# EAGLE design temp_draft (EAGLE 9.6.2)
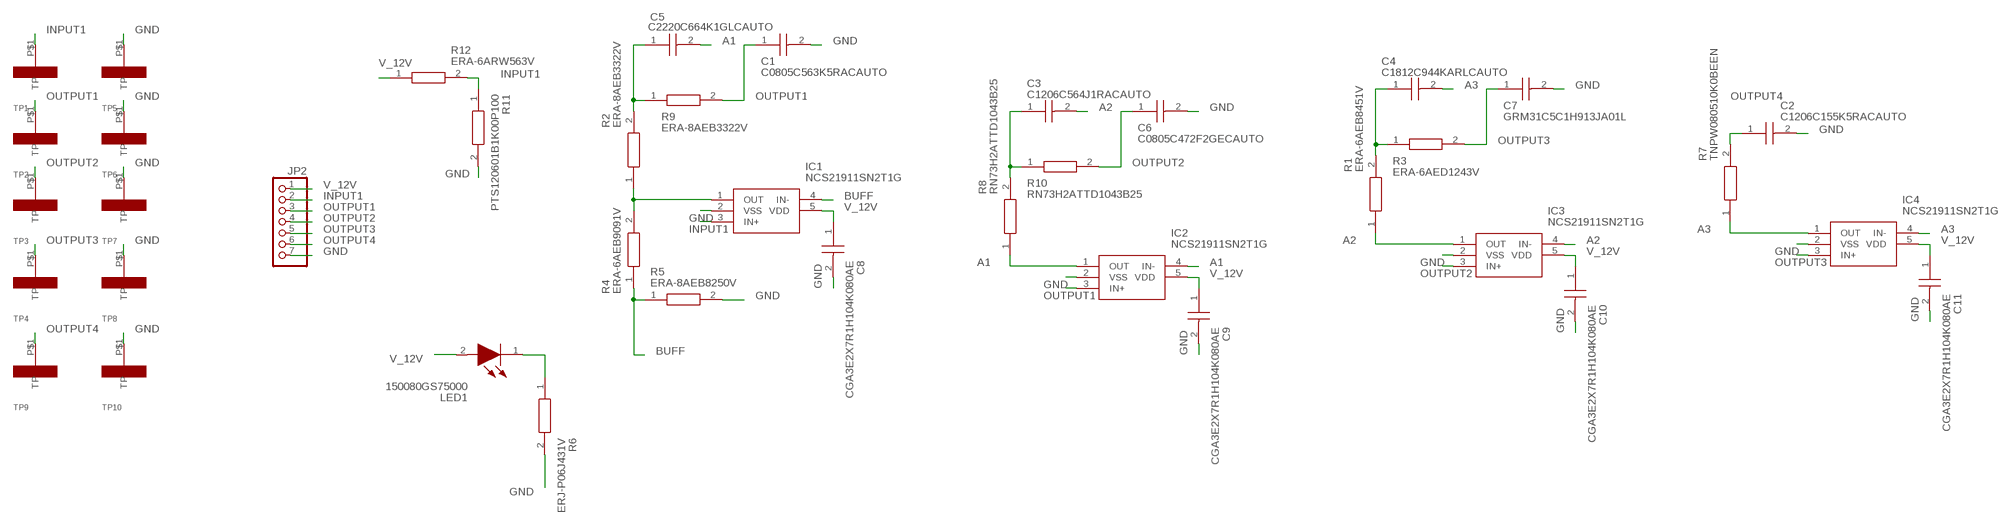
[diagram p0: schematic, sheet 1]

## Parts
C1  C0805C563K5RACAUTO  [CAPC0805C563K]
C2  C1206C155K5RACAUTO  [CAPC1206C]
C3  C1206C564J1RACAUTO  [CAPC1206]
C4  C1812C944KARLCAUTO  [CAPC4532X380N]
C5  C2220C664K1GLCAUTO  [CAPC2220]
C6  C0805C472F2GECAUTO  [CAPC2012X100N]
C7  GRM31C5C1H913JA01L  [CAPC3216X180N]
C8  CGA3E2X7R1H104K080AE  [CAPC1608X90N]
C9  CGA3E2X7R1H104K080AE  [CAPC1608X90N]
C10  CGA3E2X7R1H104K080AE  [CAPC1608X90N]
C11  CGA3E2X7R1H104K080AE  [CAPC1608X90N]
IC1  NCS21911SN2T1G  [SOT95P275X110-5N]
IC2  NCS21911SN2T1G  [SOT95P275X110-5N]
IC3  NCS21911SN2T1G  [SOT95P275X110-5N]
IC4  NCS21911SN2T1G  [SOT95P275X110-5N]
JP2  PINHD-1X7  [1X07]
LED1  150080GS75000  [LEDM2012X80N]
R1  ERA-6AEB8451V  [ERA6A_(0805)]
R2  ERA-8AEB3322V  [ERA8A_(0805)]
R3  ERA-6AED1243V  [ERA6A_(0805)]
R4  ERA-6AEB9091V  [ERA6A_(0805)]
R5  ERA-8AEB8250V  [ERA8A_(0805)]
R6  ERJ-P06J431V  [ERJP06_(0805)]
R7  TNPW080510K0BEEN  [RESC2013X65N]
R8  RN73H2ATTD1043B25  [ERA6A_(0805)]
R9  ERA-8AEB3322V  [ERA8A_(0805)]
R10  RN73H2ATTD1043B25  [ERA6A_(0805)]
R11  PTS120601B1K00P100  [PTS1206]
R12  ERA-6ARW563V  [ERA6A_(0805)]
TP1  S1751-46R  [1.85X3.45_MM]
TP2  S1751-46R  [1.85X3.45_MM]
TP3  S1751-46R  [1.85X3.45_MM]
TP4  S1751-46R  [1.85X3.45_MM]
TP5  S1751-46R  [1.85X3.45_MM]
TP6  S1751-46R  [1.85X3.45_MM]
TP7  S1751-46R  [1.85X3.45_MM]
TP8  S1751-46R  [1.85X3.45_MM]
TP9  S1751-46R  [1.85X3.45_MM]
TP10  S1751-46R  [1.85X3.45_MM]

## Nets
A1: C5.2 IC2.1(OUT) IC2.4(IN-) R8.1
A2: C3.2 IC3.1(OUT) IC3.4(IN-) R1.1
A3: C4.2 IC4.1(OUT) IC4.4(IN-) R7.1
BUFF: IC1.4(IN-) R4.1 R5.1
GND: C1.2 C2.2 C6.2 C7.2 C8.2 C9.2 C10.2 C11.2 IC1.2(VSS) IC2.2(VSS) IC3.2(VSS) IC4.2(VSS) JP2.7 R5.2 R6.2 R11.2 TP5.P$1(TP) TP6.P$1(TP) TP7.P$1(TP) TP8.P$1(TP) TP10.P$1(TP)
INPUT1: IC1.3(IN+) JP2.2 R11.1 R12.2 TP1.P$1(TP)
N$1: IC1.1(OUT) R2.1 R4.2
N$5: C3.1 R8.2 R10.1
N$6: C5.1 R2.2 R9.1
N$7: C4.1 R1.2 R3.1
N$20: LED1.1(K) R6.1
OUTPUT1: C1.1 IC2.3(IN+) JP2.3 R9.2 TP2.P$1(TP)
OUTPUT2: C6.1 IC3.3(IN+) JP2.4 R10.2 TP3.P$1(TP)
OUTPUT3: C7.1 IC4.3(IN+) JP2.5 R3.2 TP4.P$1(TP)
OUTPUT4: C2.1 JP2.6 R7.2 TP9.P$1(TP)
V_12V: C8.1 C9.1 C10.1 C11.1 IC1.5(VDD) IC2.5(VDD) IC3.5(VDD) IC4.5(VDD) JP2.1 LED1.2(A) R12.1

## Library data of the parts
C1 = SamacSys_Parts:C0805C563K5RACAUTO: Multilayer Ceramic Capacitors MLCC - SMD/SMT 50V 0.056uF X7R 0805 10% AEC-Q200 Source: Datasheet <https://www.mouser.com/datasheet/2/212/KEM_C1023_X7R_AUTO_SMD-1093309.pdf>; DESCRIPTION: Multilayer Ceramic Capacitors MLCC - SMD/SMT 50V 0.056uF X7R 0805 10% AEC-Q200; HEIGHT: 0.9mm; MANUFACTURER_NAME: Kemet; MANUFACTURE_PART_NUMBER: C0805C563K5RACAUTO; MOUSER_PART_NUMBER: 80-C0805C563K5RAUTO; MOUSER_PRICE-STOCK: https://www.mouser.com/ProductDetail/KEMET/C0805C563K5RACAUTO?qs=sGAEpiMZZMvsSlwiRhF8qhq1yIqtqizHj9MHQJANp6GepaPhQIZJkQ%3D%3D
C2 = SamacSys_Parts:C1206C155K5RACAUTO: Multilayer Ceramic Capacitors MLCC - SMD/SMT 50V 1.5uF X7R 1206 10% AEC-Q200 Source: Datasheet <https://www.mouser.com/datasheet/2/212/KEM_C1023_X7R_AUTO_SMD-1093309.pdf>; DESCRIPTION: Multilayer Ceramic Capacitors MLCC - SMD/SMT 50V 1.5uF X7R 1206 10% AEC-Q200; HEIGHT: 1.6mm; MANUFACTURER_NAME: Kemet; MANUFACTURE_PART_NUMBER: C1206C155K5RACAUTO; MOUSER_PART_NUMBER: 80-C1206C155K5RAUTO; MOUSER_PRICE-STOCK: https://www.mouser.com/ProductDetail/KEMET/C1206C155K5RACAUTO?qs=sGAEpiMZZMvsSlwiRhF8qtsBU8Zhqm2RiyVNR5SAROER%2FOmnVcYfaQ%3D%3D
C3 = SamacSys_Parts:C1206C564J1RACAUTO: Multilayer Ceramic Capacitors MLCC - SMD/SMT 100V 0.56uF X7R 1206 5% AEC-Q200 Source: Datasheet <https://www.mouser.com/ProductDetail/KEMET/C1206C564J1RACAUTO?qs=sGAEpiMZZMvsSlwiRhF8qtbmv%2FbKa1yYUWBlfJVYdwVDZKQkcrnd%2Fw%3D%3D>; DESCRIPTION: Multilayer Ceramic Capacitors MLCC - SMD/SMT 100V 0.56uF X7R 1206 5% AEC-Q200; HEIGHT: 1.25mm; MANUFACTURER_NAME: Kemet; MANUFACTURE_PART_NUMBER: C1206C564J1RACAUTO; MOUSER_PART_NUMBER: 80-C1206C564J1RAUTO; MOUSER_PRICE-STOCK: https://www.mouser.com/ProductDetail/KEMET/C1206C564J1RACAUTO?qs=sGAEpiMZZMvsSlwiRhF8qtbmv%2FbKa1yYUWBlfJVYdwVDZKQkcrnd%2Fw%3D%3D
C4 = SamacSys_Parts:C1812C944KARLCAUTO: Multilayer Ceramic Capacitors MLCC - SMD/SMT 250V 0.94uF X7R 1812 10% AEC-Q200 Source: Datasheet <https://www.kemet.com/specsheet/C1812C944KARLCAUTO>; DESCRIPTION: Multilayer Ceramic Capacitors MLCC - SMD/SMT 250V 0.94uF X7R 1812 10% AEC-Q200; HEIGHT: 3.8mm; MANUFACTURER_NAME: Kemet; MANUFACTURER_PART_NUMBER: C1812C944KARLCAUTO; MOUSER_PART_NUMBER: 80-C1812C944KARLAUTO; MOUSER_PRICE-STOCK: https://www.mouser.co.uk/ProductDetail/KEMET/C1812C944KARLCAUTO/?qs=W%2FMpXkg%252BdQ506CIIBjctjQ%3D%3D
C5 = SamacSys_Parts:C2220C664K1GLCAUTO: Multilayer Ceramic Capacitors MLCC - SMD/SMT 100V 660KpF 2220 C0G w/KONNEKT AECQ2 Source: Datasheet <https://www.mouser.com/datasheet/2/212/1/KEM_C1113_KONNEKT_C0G-2584775.pdf>; DESCRIPTION: Multilayer Ceramic Capacitors MLCC - SMD/SMT 100V 660KpF 2220 C0G w/KONNEKT AECQ2; HEIGHT: 3.5mm; MANUFACTURER_NAME: KEMET; MANUFACTURER_PART_NUMBER: C2220C664K1GLCAUTO; MOUSER_PART_NUMBER: 80-C2220C664K1GLAUTO; MOUSER_PRICE-STOCK: https://www.mouser.com/ProductDetail/KEMET/C2220C664K1GLCAUTO?qs=sGAEpiMZZMvsSlwiRhF8qrQG6leidpLjB8briebo9ApJxBKS7Wfxkg%3D%3D
C6 = SamacSys_Parts:C0805C472F2GECAUTO: ic Source: Datasheet <https://content.kemet.com/datasheets/KEM_C1003_C0G_SMD.pdf>; DESCRIPTION: ic; HEIGHT: 1mm; MANUFACTURER_NAME: Kemet; MANUFACTURER_PART_NUMBER: C0805C472F2GECAUTO; MOUSER_PART_NUMBER: 80-C0805C472F2GECAUT; MOUSER_PRICE-STOCK: https://www.mouser.co.uk/ProductDetail/KEMET/C0805C472F2GECAUTO/?qs=MLItCLRbWsxYq%252BaGNtguHw%3D%3D
C7 = SamacSys_Parts:GRM31C5C1H913JA01L: Chip Capacitor value 913 Source: Datasheet <http://www.murata.com/~/media/webrenewal/support/library/catalog/products/capacitor/mlcc/c02e.pdf>; DESCRIPTION: Chip Capacitor value 913; HEIGHT: 1.8mm; MANUFACTURER_NAME: Murata Electronics; MANUFACTURER_PART_NUMBER: GRM31C5C1H913JA01L
C8-C11 = SamacSys_Parts:CGA3E2X7R1H104K080AE: Source: Datasheet; HEIGHT: 0.9mm; MANUFACTURER_NAME: TDK; MANUFACTURER_PART_NUMBER: CGA3E2X7R1H104K080AE; MOUSER_PART_NUMBER: 810-CGA3E2X7R1H104KE; MOUSER_PRICE-STOCK: https://www.mouser.co.uk/ProductDetail/TDK/CGA3E2X7R1H104K080AE?qs=n%2FVzw7c4a0kvajqFvEbDzQ%3D%3D
IC1-IC4 = SamacSys_Parts:NCS21911SN2T1G: Operational Amplifiers - Op Amps 2 MHz Source: Datasheet <https://www.arrow.com/en/products/ncs21911sn2t1g/on-semiconductor>; DESCRIPTION: Operational Amplifiers - Op Amps 2 MHz; HEIGHT: 1.1mm; MANUFACTURER_NAME: ON Semiconductor; MANUFACTURER_PART_NUMBER: NCS21911SN2T1G; MOUSER_PART_NUMBER: 863-NCS21911SN2T1G; MOUSER_PRICE-STOCK: https://www.mouser.co.uk/ProductDetail/ON-Semiconductor/NCS21911SN2T1G/?qs=%252B6g0mu59x7Ix%2FTFBhvJ5Cw%3D%3D
JP2 = pinhead:PINHD-1X7: PIN HEADER
LED1 = SamacSys_Parts:150080GS75000: 150080GS75000, Wurth Elektronik WL-SMCW 520 nm Green LED, 2012 (0805) Clear SMD package Source: Datasheet <https://katalog.we-online.com/led/datasheet/150080GS75000.pdf>; DESCRIPTION: 150080GS75000, Wurth Elektronik WL-SMCW 520 nm Green LED, 2012 (0805) Clear SMD package; HEIGHT: 0.8mm; MANUFACTURER_NAME: Wurth Elektronik; MANUFACTURER_PART_NUMBER: 150080GS75000; MOUSER_PART_NUMBER: 710-150080GS75000; MOUSER_PRICE-STOCK: https://www.mouser.co.uk/ProductDetail/Wurth-Elektronik/150080GS75000?qs=2kOmHSv6VfQRoTEZVk1mGA%3D%3D
R1 = SamacSys_Parts:ERA-6AEB8451V: Thin Film Resistors - SMD 0805 8.45Kohm 0.1% 25ppm Source: Datasheet <https://componentsearchengine.com/Datasheets/1/ERA-6AEB8451V.pdf>; DESCRIPTION: Thin Film Resistors - SMD 0805 8.45Kohm 0.1% 25ppm; HEIGHT: 0.6mm; MANUFACTURER_NAME: Panasonic; MANUFACTURER_PART_NUMBER: ERA-6AEB8451V; MOUSER_PART_NUMBER: 667-ERA-6AEB8451V; MOUSER_PRICE-STOCK: https://www.mouser.com/Search/Refine.aspx?Keyword=667-ERA-6AEB8451V
R2 R9 = SamacSys_Parts:ERA-8AEB3322V: Thin Film Resistors - SMD 1206 33.2Kohm 25ppm 0.1% AEC-Q200 Source: Datasheet <http://industrial.panasonic.com/cdbs/www-data/pdf/RDM0000/AOA0000C307.pdf>; DESCRIPTION: Thin Film Resistors - SMD 1206 33.2Kohm 25ppm 0.1% AEC-Q200; HEIGHT: 0.7mm; MANUFACTURER_NAME: Panasonic; MANUFACTURER_PART_NUMBER: ERA-8AEB3322V; MOUSER_PART_NUMBER: 667-ERA-8AEB3322V; MOUSER_PRICE-STOCK: https://www.mouser.co.uk/ProductDetail/Panasonic/ERA-8AEB3322V?qs=MNPzkKEzRtRCJyPyYFTruw%3D%3D
R3 = SamacSys_Parts:ERA-6AED1243V: Metal Thin Film Chip Resistor, 0805, 0.125W Source: Datasheet <http://industrial.panasonic.com/cdbs/www-data/pdf/RDM0000/AOA0000C307.pdf>; DESCRIPTION: Metal Thin Film Chip Resistor, 0805, 0.125W; HEIGHT: 0.6mm; MANUFACTURER_NAME: Panasonic; MANUFACTURER_PART_NUMBER: ERA-6AED1243V
R4 = SamacSys_Parts:ERA-6AEB9091V: Thin Film Resistors - SMD 0805 9.09Kohm 0.1% 25ppm Source: Datasheet <https://componentsearchengine.com/Datasheets/1/ERA-6AEB9091V.pdf>; DESCRIPTION: Thin Film Resistors - SMD 0805 9.09Kohm 0.1% 25ppm; HEIGHT: 0.6mm; MANUFACTURER_NAME: Panasonic; MANUFACTURER_PART_NUMBER: ERA-6AEB9091V; MOUSER_PART_NUMBER: 667-ERA-6AEB9091V; MOUSER_PRICE-STOCK: https://www.mouser.com/Search/Refine.aspx?Keyword=667-ERA-6AEB9091V
R5 = SamacSys_Parts:ERA-8AEB8250V: Metal Thin Film Chip Resistor, 1206, 0.25W Source: Datasheet <http://industrial.panasonic.com/cdbs/www-data/pdf/RDM0000/AOA0000C307.pdf>; DESCRIPTION: Metal Thin Film Chip Resistor, 1206, 0.25W; HEIGHT: 0.7mm; MANUFACTURER_NAME: Panasonic; MANUFACTURER_PART_NUMBER: ERA-8AEB8250V
R6 = SamacSys_Parts:ERJ-P06J431V: Thick Film Resistors - SMD 0805 430ohms 0.5W 5% AEC-Q200 Source: Datasheet <https://componentsearchengine.com/Datasheets/1/ERJ-P06J431V.pdf>; DESCRIPTION: Thick Film Resistors - SMD 0805 430ohms 0.5W 5% AEC-Q200; HEIGHT: 0.7mm; MANUFACTURER_NAME: Panasonic; MANUFACTURER_PART_NUMBER: ERJ-P06J431V; MOUSER_PART_NUMBER: 667-ERJ-P06J431V; MOUSER_PRICE-STOCK: https://www.mouser.com/Search/Refine.aspx?Keyword=667-ERJ-P06J431V
R7 = SamacSys_Parts:TNPW080510K0BEEN: RESISTOR, 0805 10K Ohms +/-0.1% 0.125 W Source: Datasheet; DESCRIPTION: RESISTOR, 0805 10K Ohms +/-0.1% 0.125 W; HEIGHT: mm; MANUFACTURER_NAME: Vishay; MANUFACTURER_PART_NUMBER: TNPW080510K0BEEN; MOUSER_PART_NUMBER: 71-TNPW080510K0BEEN; MOUSER_PRICE-STOCK: https://www.mouser.co.uk/ProductDetail/Vishay-Dale/TNPW080510K0BEEN?qs=dafR6q3Fy0zykY041qLtTg%3D%3D
R8 R10 = SamacSys_Parts:RN73H2ATTD1043B25: Thin Film Resistors 104kOhm,0805,0.1%,25 ppm,125mW,100V Source: Datasheet <https://www.mouser.com/datasheet/2/219/RN73H-1843478.pdf>; DESCRIPTION: Thin Film Resistors 104kOhm,0805,0.1%,25 ppm,125mW,100V; HEIGHT: 0.5mm; MANUFACTURER_NAME: KOA Speer; MANUFACTURER_PART_NUMBER: RN73H2ATTD1043B25; MOUSER_PART_NUMBER: 660-RN73H2ATD1043B25; MOUSER_PRICE-STOCK: https://www.mouser.com/ProductDetail/KOA-Speer/RN73H2ATTD1043B25?qs=sGAEpiMZZMvdGkrng054t2X2hYGb0FuJtgKEkX9f1Wo%3D
R11 = SamacSys_Parts:PTS120601B1K00P100: Board Mount Temperature Sensors 1206 1Kohms RTD 0.1mA-0.25mA Source: Datasheet <https://www.mouser.com/datasheet/2/427/ptsserie-1762313.pdf>; DESCRIPTION: Board Mount Temperature Sensors 1206 1Kohms RTD 0.1mA-0.25mA; HEIGHT: 0.55; MANUFACTURE_NAME: Vishay; MANUFACTURE_PART_NUMBER: PTS120601B1K00P100; MOUSER_PART_NUMBER: 594-PTS120601B1K00P; MOUSER_PRICE-STOCK: https://www.mouser.com/ProductDetail/Vishay-Beyschlag/PTS120601B1K00P100?qs=%2Fha2pyFadugOom2CU56%252BW%2F5yQAqyz8PWrw2L1Ww9rx7Z3WBt3fdUJYs6dOXMwGHb
R12 = SamacSys_Parts:ERA-6ARW563V: Metal Thin Film Chip Resistor, 0805, 0.125W Source: Datasheet <http://industrial.panasonic.com/cdbs/www-data/pdf/RDM0000/AOA0000C307.pdf>; DESCRIPTION: Metal Thin Film Chip Resistor, 0805, 0.125W; HEIGHT: 0.6mm; MANUFACTURER_NAME: Panasonic; MANUFACTURER_PART_NUMBER: ERA-6ARW563V
TP1-TP10 = SamacSys_Parts:S1751-46R

## Board
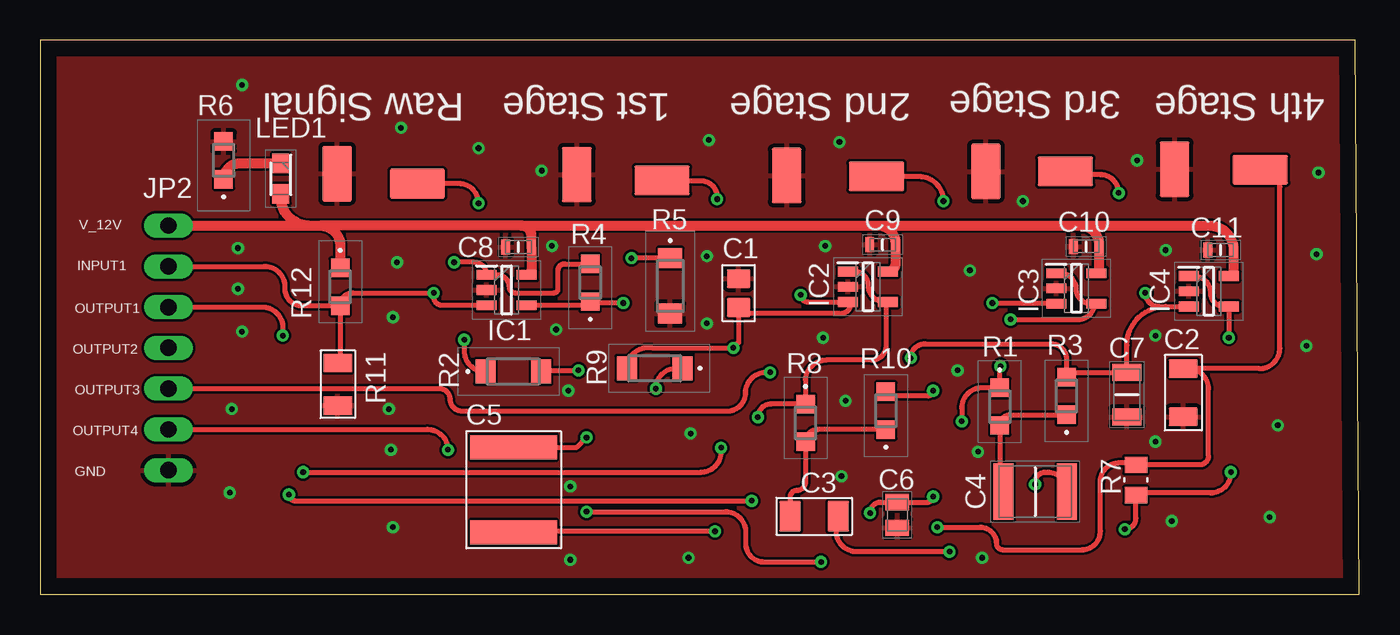
[diagram p1: board, top side]
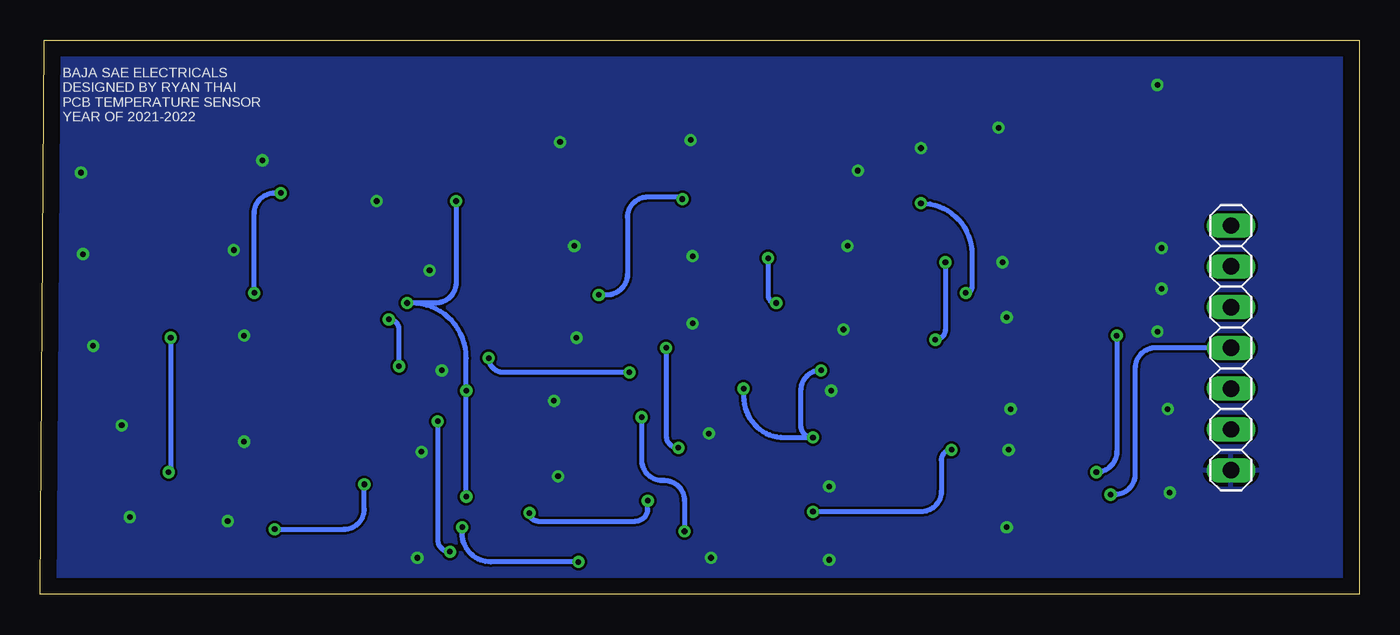
[diagram p2: board, bottom side, seen from below]

Size 82.17 x 34.54 mm. Coordinates in mm from the lower left corner, seen from the top.
Outline: 0,0 82.17,0 81.91,34.54 0,34.54 0,0
Copper layers (1*16): Top 0.035mm / dielectric 1.5mm / Bottom 0.035mm
Design rules "default *": minimum track width 6mil, minimum drill 0.35mm, track to track 6mil, track to pad 6mil, pad to pad 6mil, via to via 6mil, smd to smd 6mil, copper to edge 40mil, drill to drill 6mil, minimum pad ring 10mil, minimum via ring 8mil, stop-mask expansion 4mil, vias tented up to drill 15mil, thermal gap 10mil

### Footprints (pad centres in the part's own frame; a part is rotated, then mirrored left to right if it is on the bottom)
CAPC0805C563K = smd 1.15 x 1.45: 1 0,0; 2 1.8,0
CAPC1206C = smd 1.15 x 1.8: 1 0,0; 2 3,0
CAPC1206 = smd 1.35 x 1.9: 1 0,0; 2 3,0
CAPC4532X380N = smd 1.25 x 3.52: 1 -1.98,0; 2 1.98,0
CAPC2220 = smd 1.5 x 5.4: 1 0,0; 2 5.3,0
CAPC2012X100N = smd 1.02 x 1.47: 1 -0.8,0; 2 0.8,0
CAPC3216X180N = smd 1.07 x 1.82: 1 -1.38,0; 2 1.38,0
CAPC1608X90N = smd 0.54 x 0.94: 1 -0.8,0; 2 0.8,0
SOT95P275X110-5N = smd 1.25 x 0.6: 1 -1.25,0.95; 2 -1.25,0; 3 -1.25,-0.95; 4 1.25,-0.95; 5 1.25,0.95
1X07 = drill 1.016 long: 1 -7.62,0; 2 -5.08,0; 3 -2.54,0; 4 0,0; 5 2.54,0; 6 5.08,0; 7 7.62,0
LEDM2012X80N = smd 1.2 x 1.05: 1 -0.95,0; 2 0.95,0
ERA6A_(0805) = smd 1.15 x 1.15: 1 -1.175,0; 2 1.175,0
ERA8A_(0805) = smd 1.25 x 1.5: 1 -1.725,0; 2 1.725,0
ERJP06_(0805) = smd 1.15 x 1.15: 1 -1.175,0; 2 1.175,0
RESC2013X65N = smd 1.016 x 1.397: 1 -0.94,0; 2 0.94,0
PTS1206 = smd 1.15 x 1.75: 1 0,0; 2 2.65,0
1.85X3.45_MM = smd 1.85 x 3.45: P$1 -0.94,1.702

### Placement (x,y rotation side)
C1  43.51,17.88 90 top
C2  71.2,14.07 270 top
C3  46.71,4.88 0 top
C4  61.98,6.4 0 top
C5  29.49,9.17 270 top
C6  53.39,4.95 270 top
C7  67.69,12.45 270 top
C8  29.79,21.64 180 top
C9  52.48,21.79 180 top
C10  65.15,21.69 180 top
C11  73.53,21.46 180 top
IC1  29.06,18.97 0 top
IC2  51.56,19.18 0 top
IC3  64.54,19.08 0 top
IC4  72.8,18.9 0 top
JP2  8,15.37 270 bottom
LED1  14.99,25.91 270 top
R1  59.77,11.71 270 top
R2  29.46,13.89 0 top
R3  63.93,12.37 90 top
R4  34.26,19.43 90 top
R5  39.24,19.23 270 top
R6  11.43,27.05 90 top
R7  68.25,7.14 90 top
R8  47.68,10.69 270 top
R9  38.28,14.1 180 top
R10  52.68,11.46 90 top
R11  18.54,14.43 270 top
R12  18.69,19.18 270 top
TP1  21.79,24.66 270 top
TP2  37.03,24.87 270 top
TP3  50.39,25.12 270 top
TP4  62.15,25.43 270 top
TP5  57.96,28.07 180 top
TP6  45.57,27.81 180 top
TP7  32.49,27.86 180 top
TP8  17.55,27.91 180 top
TP9  74.3,25.53 270 top
TP10  69.72,28.19 180 top

### Tracks (layer width: path | path; a pad name or v marks a point on that pad's centre or on a via)
A1  (via drill 0.35)
  Top 0.305: IC2.1 50.74,20.13 arc-90 51.56,19.3 arc90 52.64,18.23 IC2.4 52.68,18.1 52.68,15.49 arc-90 51.8,14.61 48.95,14.61 arc90 47.68,13.34 R8.1 45.52,11.87 arc90 v44.7,11.05 | v42.04,3.94 29.56,3.94 arc90 C5.2
  Bottom 0.305: v44.7,11.05 44.7,8.38 arc-90 43.43,7.11 43.31,7.11 arc90 42.04,5.84 v42.04,3.94
A2  (via drill 0.35)
  Top 0.305: IC3.1 63.54,20.02 arc-90 64.52,19.05 arc90 65.44,18.12 65.66,18.12 | 65.66,18.12 IC3.4 | v59.82,14.22 arc90 59.77,14.17 R1.1 58.67,12.88 arc90 57.4,11.61 v57.4,10.79 | v60.45,17.14 64.68,17.14 arc90 65.66,18.12 | v56.64,2.67 50.85,2.67 arc-90 49.58,3.94 49.58,4.75 C3.2
  Bottom 0.305: v59.82,14.22 59.82,16.51 arc-90 v60.45,17.14 | v57.4,10.79 57.4,3.43 arc-90 v56.64,2.67
A3  (via drill 0.35)
  Top 0.305: IC4.1 71.85,19.85 arc-90 72.9,18.8 arc90 73.75,17.95 IC4.4 v74.05,16.01 arc-90 v74.04,16 | v67.56,4.06 arc90 68.25,4.75 R7.1 68.38,6.33 72.9,6.33 arc90 74.17,7.59 v74.17,7.62 | v61.98,6.86 61.98,6.99 arc-90 62.61,7.62 62.74,7.62 arc-90 C4.2
  Bottom 0.305: v67.56,4.06 63.25,4.06 arc-90 61.98,5.33 v61.98,6.86 | v74.04,16 74.04,7.75 arc90 v74.17,7.62
BUFF  (via drill 0.35)
  Top 0.305: IC1.4 34.03,18.02 arc90 R4.1 arc90 34.36,18.16 v36.32,18.16 | v36.83,20.95 R5.1
  Bottom 0.305: v36.83,20.95 36.83,18.67 arc-90 v36.32,18.16
GND  (via drill 0.35)
  other vias: 12.57,31.75 22.23,20.7 27.3,27.81 22.48,29.08 21.72,11.56 21.84,9.02 11.81,6.35 41.66,28.32 79.63,26.29 79.5,21.21 78.87,15.49 77.09,10.54 76.58,4.83 58.67,2.29 40.39,2.29 33.02,2.16 21.97,4.19 48.89,21.72 41.53,21.08 68.33,27.05 70.1,21.46 70.48,4.57 40.51,10.03 12.32,19.05 12.32,21.59 21.97,17.27 12.57,16.38 11.94,11.56 33.02,6.73 41.53,16.89 31.24,26.42 49.78,28.19 61.21,24.51 57.91,20.19 57.15,13.97 58.42,8.89 69.47,16.13 31.88,21.72 32.13,16.51 32.89,12.7 49.91,7.37 50.16,12.06 48.77,16 69.47,9.53
  pour Top: 0,34.67 0,0 82.04,0 82.04,34.54 8,34.67
  pour Bottom: 0,34.54 0,-1.14 81.91,-1.14 81.91,34.54
INPUT1  (via drill 0.35)
  Top 0.305: JP2.2 13.97,20.45 arc-90 15.24,19.18 15.24,19.05 arc90 16.29,18 R12.2 | R12.2 18.69,14.58 arc-90 R11.1 | IC1.3 25.03,18.02 arc-90 24.51,18.54 v24.51,18.8 19.49,18.8 arc90 R12.2 | v27.3,24.38 arc90 26.09,25.6 TP1.P$1
  Bottom 0.305: v27.3,24.38 arc90 24.13,21.21 24.13,19.18 arc90 v24.51,18.8
N$1  (via drill 0.35)
  Top 0.305: v26.42,15.88 26.42,15.16 arc90 27.69,13.89 R2.1 | R4.2 32.67,20.61 arc90 32.26,20.19 32.26,19.05 arc-90 32,18.8 29.59,18.8 arc-90 29.21,19.18 arc90 28.46,19.92 IC1.1 arc90 27.03,20.7 v25.78,20.7
  Bottom 0.305: v25.78,20.7 25.78,16.51 arc90 v26.42,15.88
N$5
  Top 0.305: R10.1 48.44,10.28 arc90 R8.2 47.68,7.04 arc-90 47.12,6.48 arc90 46.71,6.07 C3.1
N$6  (via drill 0.35)
  Top 0.305: R2.2 arc-90 31.27,13.97 v33.53,13.97 | C5.1 33.43,9.17 v34.04,9.78 | v38.35,12.83 arc-90 39.62,14.1 R9.1
  Bottom 0.305: v33.53,13.97 arc-90 34.8,12.7 34.8,10.54 arc-90 v34.04,9.78 35.81,9.78 arc90 38.35,12.32 v38.35,12.83
N$7
  Top 0.305: R3.1 60.43,11.2 arc90 R1.2 59.77,6.63 arc90 C4.1
N$20
  Top 0.61: LED1.1 12.41,26.86 arc90 R6.1
OUTPUT1  (via drill 0.35)
  Top 0.305: v47.37,18.67 arc90 47.81,18.23 IC2.3 50.55,18.23 arc-90 49.82,17.5 43.89,17.5 C1.1 43.51,15.7 v43.18,15.37 38.1,15.37 37.82,15.37 arc90 R9.2 36.55,14.22 | JP2.3 13.84,17.91 arc-90 15.11,16.64 v15.11,16.13 | v16.38,7.62 41.15,7.62 arc90 42.42,8.89 v42.42,9.14 | TP2.P$1 38.76,25.78 41.15,25.78 arc-90 42.16,24.77 v42.16,24.64
  Bottom 0.305: v43.18,15.37 43.18,9.91 arc-90 v42.42,9.14 | v15.11,16.13 15.11,8.89 arc90 v16.38,7.62 | v47.37,18.67 46.86,18.67 arc-90 45.59,19.94 45.59,23.5 arc90 44.32,24.77 42.29,24.77 arc90 v42.16,24.64
OUTPUT2  (via drill 0.35)
  Top 0.305: v55.63,6.1 arc-90 55.28,5.75 C6.1 52.36,5.75 arc90 v51.69,5.08 | IC3.3 59.34,18.12 v59.31,18.16 | R10.2 52.93,12.38 55.3,12.38 arc90 v55.63,12.7 | v15.49,6.22 arc90 15.88,5.84 v44.32,5.84 | TP3.P$1 54.71,26.06 arc-90 v56.26,24.51
  Bottom 0.305: v55.63,6.1 v55.63,12.7 55.63,14.73 arc-90 59.05,18.16 v59.31,18.16 57.53,18.16 arc-90 56.26,19.43 v56.26,24.51 | JP2.4 12.7,15.37 arc-90 13.97,14.1 13.97,7.49 arc90 15.24,6.22 v15.49,6.22 | v51.69,5.08 arc-90 51.18,4.57 45.09,4.57 arc-90 44.32,5.33 v44.32,5.84
OUTPUT3  (via drill 0.35)
  Top 0.305: JP2.5 24.89,12.83 arc-90 25.53,12.19 arc90 26.29,11.43 42.8,11.43 arc90 43.94,12.57 arc-90 45.21,13.84 v45.47,13.84 | v54.23,14.73 arc-90 55.12,15.62 62.99,15.62 arc-90 63.93,14.68 R3.2 arc-90 64.21,13.83 C7.1 67.69,15.54 arc-90 70.1,17.95 IC4.3 69.68,17.95 arc-90 v68.83,18.8 | v67.18,25.02 arc90 66.04,26.16 64.06,26.16 TP4.P$1
  Bottom 0.305: v45.47,13.84 53.34,13.84 arc90 v54.23,14.73 | v67.18,25.02 67.56,25.02 arc-90 68.83,23.75 v68.83,18.8
OUTPUT4  (via drill 0.35)
  Top 0.305: JP2.6 24.13,10.29 arc-90 v25.4,9.02 | v34.04,5.16 42.67,5.16 arc-90 43.94,3.89 43.94,3.17 arc90 45.09,2.03 v48.64,2.03 | v55.88,4.19 58.55,4.19 arc-90 59.56,3.17 arc90 59.94,2.79 64.9,2.79 arc90 66.04,3.94 66.04,7.06 arc-90 67.18,8.2 68.12,8.2 arc90 R7.2 72.21,8.08 arc90 72.77,8.64 72.77,12.8 arc90 71.5,14.07 C2.1 | C2.1 arc-90 71.35,14.22 | 70.74,14.07 C2.1 | TP9.P$1 76.15,26.47 arc-90 77.22,25.4 77.22,15.34 arc-90 75.95,14.07 C2.1
  Bottom 0.305: v25.4,9.02 arc-90 26.04,8.38 26.04,6.43 arc90 27.3,5.16 v34.04,5.16 | v48.64,2.03 54.1,2.03 arc90 55.88,3.81 v55.88,4.19
V_12V
  Top 0.61: 30.59,20.21 arc-90 IC1.5 arc90 30.59,20.21 | IC4.5 arc90 74.33,20.13 C11.1 arc90 72.81,22.99 64.77,22.99 | 29.97,22.99 17.42,22.99 | 29.97,22.99 52.2,22.99 | 52.2,22.99 64.77,22.99 | 52.2,22.99 arc-90 53.28,21.91 C9.1 53.28,20.59 arc-90 IC2.5 | 64.77,22.99 arc-90 65.95,21.81 C10.1 65.95,20.18 arc-90 IC3.5 | JP2.1 16.76,22.99 | 16.76,22.99 17.42,22.99 | 17.42,22.99 arc-90 18.69,21.72 R12.1 | C8.1 30.59,20.21 | 16.76,22.99 arc-90 14.99,24.77 LED1.2 | C8.1 30.59,21.73 | C8.1 30.59,22.36 arc90 29.97,22.99

### Text on the board
tPlace: Raw Signal | 1st Stage | 2nd Stage | 3rd Stage | 4th Stage
tNames: V_12V | INPUT1 | OUTPUT1 | OUTPUT2 | OUTPUT3 | OUTPUT4 | GND
bNames: BAJA SAE ELECTRICALS / DESIGNED BY RYAN THAI / PCB TEMPERATURE SENSOR / YEAR OF 2021-2022